# Altium schematic sheet 1V8_SUPPLY.SchDoc: My title
size A3; Organization: University of California; Address1: 475 Portola Plaza; Address2: Los Angeles, CA 90095; DocumentNumber: 10; Revision: R01; SheetNumber: 10; SheetTotal: 35
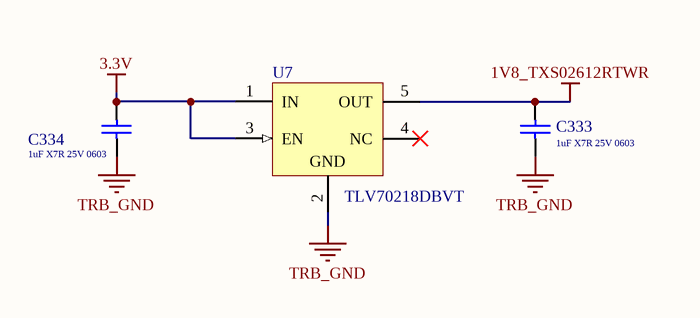
[diagram p0: 1V8_SUPPLY.SchDoc]

## Parts
C333  Capacitance: 1uF X7R 25V 0603  [Cap_Murata_GCJ188R71E105KA01J_1uF]  (hidden comment: Cap_Murata_GCJ188R71E105KA01J_1uF)
C334  Capacitance: 1uF X7R 25V 0603  [Cap_Murata_GCJ188R71E105KA01J_1uF]  (hidden comment: Cap_Murata_GCJ188R71E105KA01J_1uF)
U7  TLV70218DBVT  [TI-DBV5_N]

## Nets
1V8_TXS02612RTWR: C333.2 U7.5(OUT)
3.3V: C334.2 U7.1(IN) U7.3(EN)
TRB_GND: C333.1 C334.1 U7.2(GND)

Not connected (* = marked no-connect by the designer): U7 4(NC)*

## Notes on the sheet
- 475 Portola Plaza
- GAPS TOF
- igarcia91@g.ucla.edu
- Los Angeles, CA
- 310-825-0344
- Size:
- Date:
- Letter
- Revision:
- Time:
- Sheet
- of
- andrew.peck@cern.ch
- spq@ucla.edu
- File:

## Library data of the parts
C333 C334 = Cap_Murata_GCJ188R71E105KA01J_1uF: CAP CER 1uF 25V X7R 0603; Supplier 1: Mouser; Supplier Part Number 1: 81-GCJ188R71E105KA1J
U7 = TLV70218DBVT: Single Output LDO, 300 mA, Fixed 1.8 V Output, 2 to 5.5 V Input, with Low IQ, 5-pin SOT-23 (DBV), -40 to 125 degC, Green (RoHS & no Sb/Br); Manufacturer: Texas Instruments; Accuracy(%): 2; Iq(Typ)(mA): 0.03; Vout Adj(Min)(V): 1.8; SubFamily: Single Channel LDO; Vin(Max)(V): 5.5; Iout(Max)(A): 0.3; Vdo(Typ)(mV): 220; Vin(Min)(V): 2; Eco-Plan: Green (RoHS & no Sb/Br); PartNumber: TLV70218DBVT; ComponentLink1Description: Manufacturer URL; ComponentLink2Description: Datasheet; DatasheetVersion: SLVSAG6B; ComponentLink3URL: http://www.ti.com/litv/pdf/mpds018i; Vout Adj(Max)(V): 1.8; ComponentLink1URL: http://www.ti.com/; Fixed Output Options(V): 1.8; Code_JEDEC: MO-178; ComponentLink2URL: http://www.ti.com/general/docs/lit/getliterature.tsp?genericPartNumber=TLV70218&fileType=pdf; ComponentLink3Description: Package Specification; PackageVersion: 4073253-4/K; Mounting Technology: Surface Mount; PackageReference: DBV5; PackageDescription: 5-Pin Plastic Small Outline, Body 1.60 Ãƒâ€” 2.90 mm, Pitch 0.95 mm